# Altium project thru hole preamp amps and LP+BP filter stages.PrjPcb
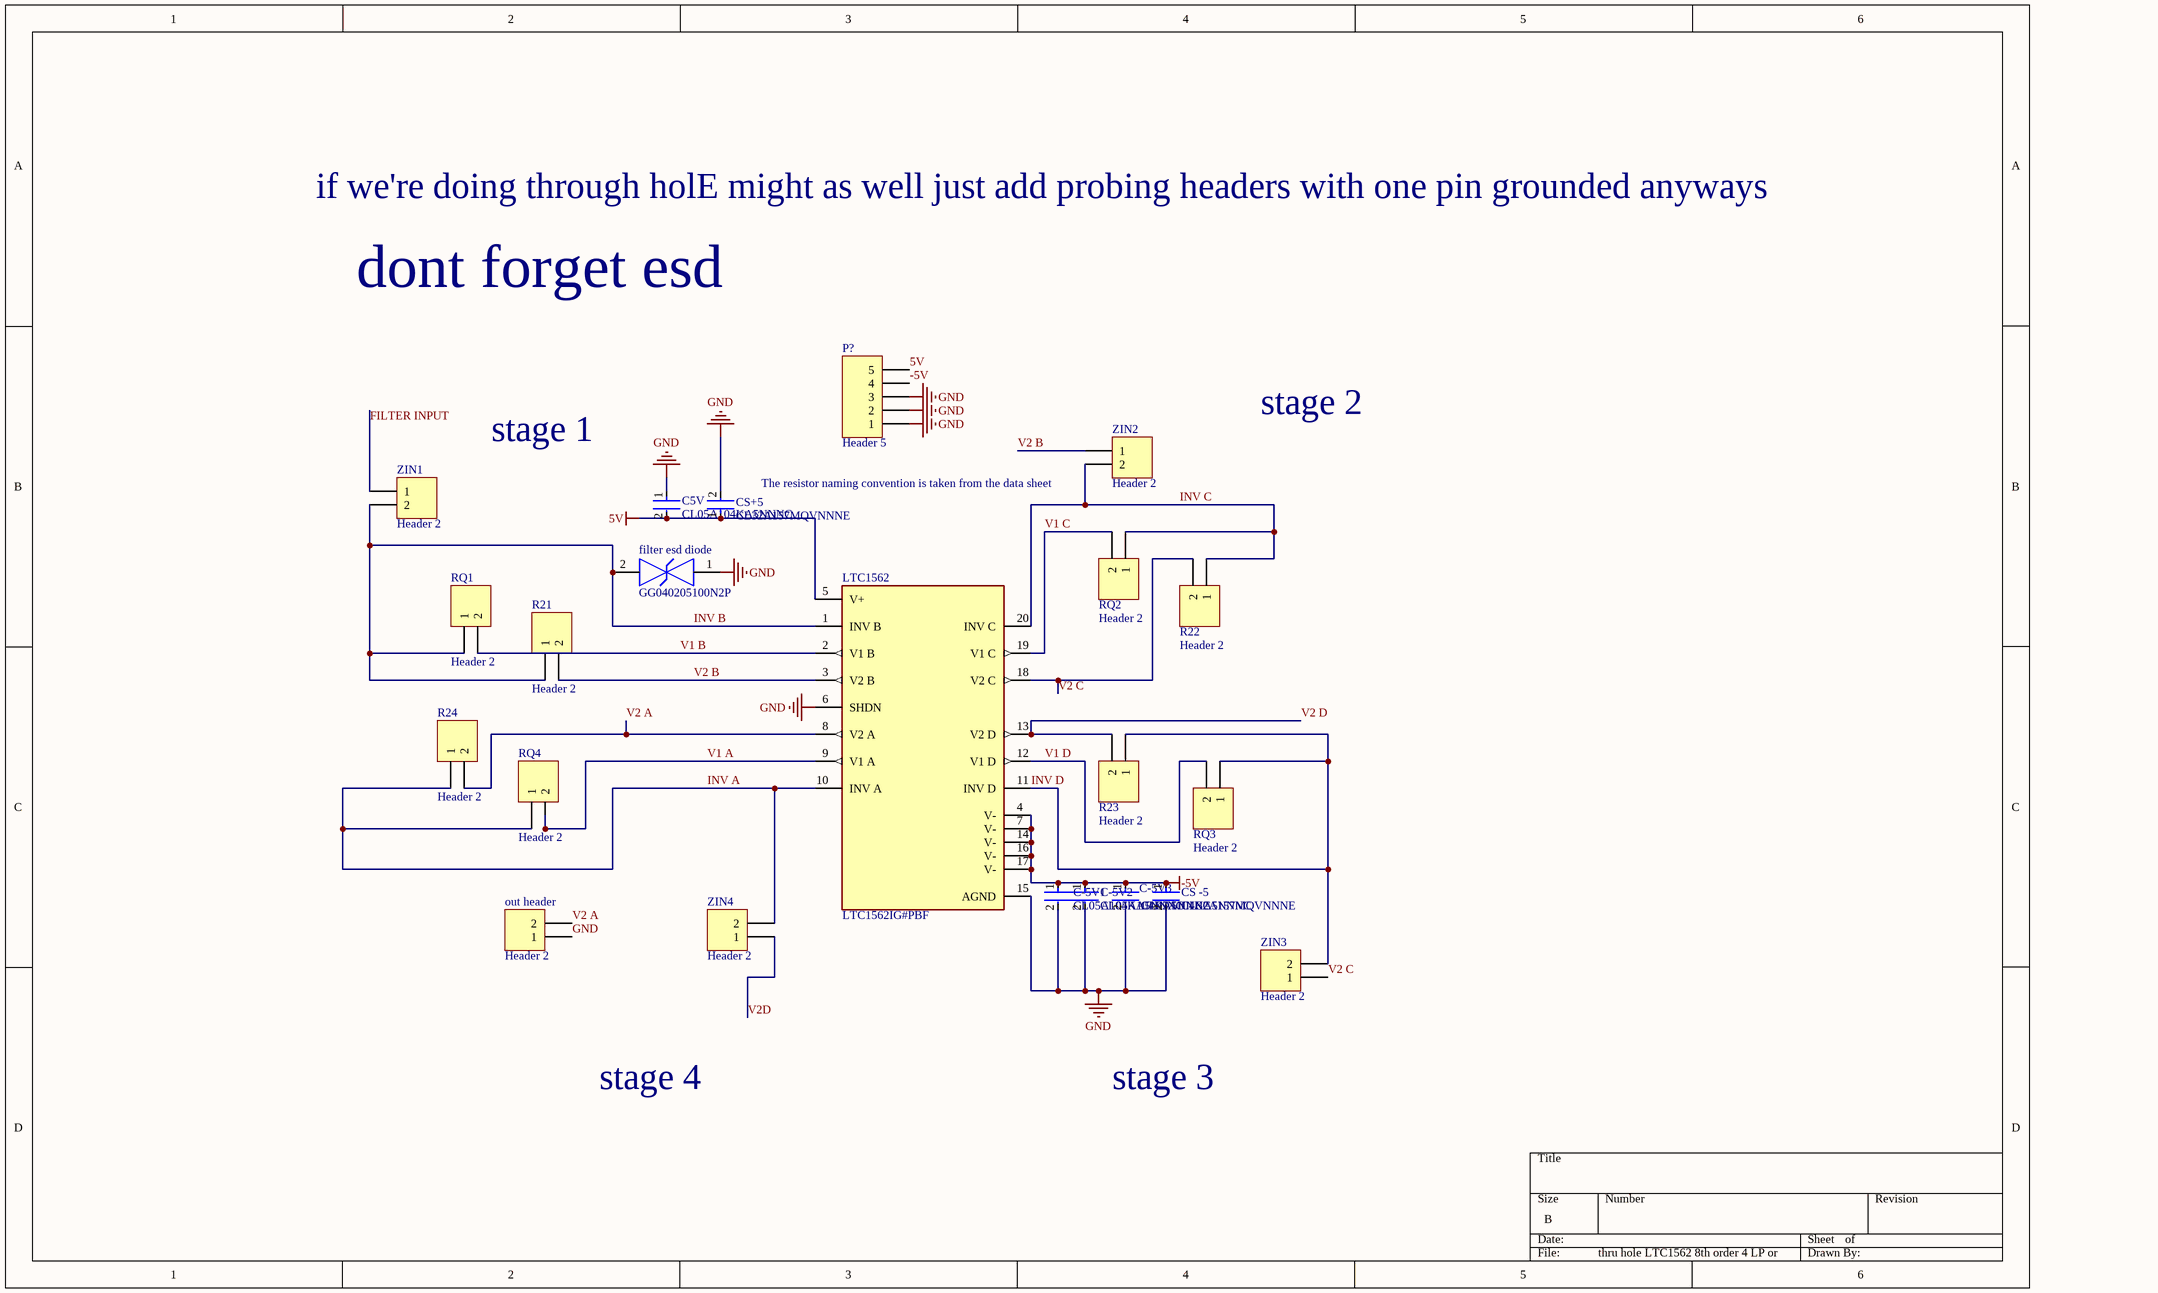
[diagram p0: thru hole LTC1562 8th order 4 LP or BP stages.SchDoc]
1 sheet, 22 parts. Net scope: global (net labels, ports and power ports of the same name join across sheets).
Board files: thru hole LTC1562 8th order 4 LP or BP stages.PcbDoc, CASCADED thru hole preamp amps and LP+BP filter stages.PcbDoc

## Sheet thru hole LTC1562 8th order 4 LP or BP stages.SchDoc
size B; SheetNumber: 1; SheetTotal: 2

### Parts
C5V  CL05A104KA5NNNC  [FP-CL278-IPC_C]
C-5V1  CL05A104KA5NNNC  [FP-CL278-IPC_C]
C-5V2  CL05A104KA5NNNC  [FP-CL278-IPC_C]
C-5V3  CL05A104KA5NNNC  [FP-CL278-IPC_C]
CS+5  CL32A157MQVNNNE  [FP-CL32-IPC_C]
CS_-5  CL32A157MQVNNNE  [FP-CL32-IPC_C]
filter_esd_diode  GG040205100N2P  [FP-GG0402-MFG]
LTC1562  LTC1562IG#PBF  [FP-G-20-05-08-1640-MFG]
out_header  Header 2  [HDR1X2]
P?  Header 5  [HDR1X5]
R21  Header 2  [HDR1X2]
R22  Header 2  [HDR1X2]
R23  Header 2  [HDR1X2]
R24  Header 2  [HDR1X2]
RQ1  Header 2  [HDR1X2]
RQ2  Header 2  [HDR1X2]
RQ3  Header 2  [HDR1X2]
RQ4  Header 2  [HDR1X2]
ZIN1  Header 2  [HDR1X2]
ZIN2  Header 2  [HDR1X2]
ZIN3  Header 2  [HDR1X2]
ZIN4  Header 2  [HDR1X2]

### Nets
5V: C5V.2 CS+5.1 LTC1562.5(V+) P?.5
-5V: C-5V1.1 C-5V2.1 C-5V3.1 CS_-5.1 LTC1562.4(V-) LTC1562.7(V-) LTC1562.14(V-) LTC1562.16(V-) LTC1562.17(V-) P?.4
GND: C5V.1 C-5V1.2 C-5V2.2 C-5V3.2 CS+5.2 CS_-5.2 filter_esd_diode.1(IO_1) LTC1562.6(SHDN) LTC1562.15(AGND) out_header.1 P?.1 P?.2 P?.3
FILTER INPUT: ZIN1.1
INV A: LTC1562.10(INV_A) R24.1 RQ4.1 ZIN4.2
INV B: filter_esd_diode.2(IO_2) LTC1562.1(INV_B) R21.1 RQ1.1 ZIN1.2
INV C: LTC1562.20(INV_C) R22.1 RQ2.1 ZIN2.2
INV D: LTC1562.11(INV_D) R23.1 RQ3.1 ZIN3.2
V1 A: LTC1562.9(V1_A) RQ4.2
V1 B: LTC1562.2(V1_B) RQ1.2
V1 C: LTC1562.19(V1_C) RQ2.2
V1 D: LTC1562.12(V1_D) RQ3.2
V2 A: LTC1562.8(V2_A) out_header.2 R24.2
V2 B: LTC1562.3(V2_B) R21.2 ZIN2.1
V2 C: LTC1562.18(V2_C) R22.2 ZIN3.1
V2 D: LTC1562.13(V2_D) R23.2
V2D: ZIN4.1

### Notes on the sheet
- if we're doing through holE might as well just add probing headers with one pin grounded anyways
- dont forget esd
- stage 2
- stage 1
- (near ZIN2) The resistor naming convention is taken from the data sheet
- stage 4
- stage 3

### Library data of the parts
C5V C-5V1-C-5V3 = CMP-13271-000728-1: Cap Ceramic 100nF 25V X5R ±10% SMD 0402 +85°C Paper T/R; Package Quantity: 1; Height: 0.5mm; Case Code (Metric): 1005; Thickness: 0.022inch; Mount: Surface Mount; Lead Free: Lead Free; Case Code (Imperial): 0402; Packaging: Tape and Reel; Depth: 0.5mm; Voltage: 25V; Min Operating Temperature: -55°C; Voltage Rating: 25V; Dielectric: X5R; Case/Package: 0402; Tolerance: 10%; Width: 0.02inch; Max Operating Temperature: 85°C; Capacitance: 100nF; Length: 1mm; Radiation Hardening: No; Voltage Rating (DC): 25V
CS+5 CS_-5 = CMP-2000-06109-2: Cap Ceramic 150uF 6.3V X5R ±20% SMD 1210 +85°C Embossed T/R; Width: 0.098inch; Case Code (Metric): 3225; Capacitance: 150uF; Case/Package: 1210; Package Quantity: 1; Voltage Rating (DC): 6.3V; Mount: Surface Mount; Packaging: Tape and Reel; Max Operating Temperature: 85°C; Case Code (Imperial): 1210; Tolerance: 20%; Length: 0.126inch; Thickness: 0.11inch; Min Operating Temperature: -55°C; Voltage Rating: 6.3V; Lead Free: Lead Free
filter_esd_diode = CMP-04587-000001-1: TVS DIODE 5V 12V 0402; Manufacturer: AVX Corporation; Number Of Channels: 1; Peak Pulse Current: 16A; Capacitance: 10pF; Direction: Bidirectional; Value: 10pF; Breakdown Voltage: 5.5V; Peak Pulse Power: 96W; Automotive: No; ComponentLink2URL: http://datasheets.avx.com/AVX-GiGuard.pdf; Manufacturer Part Number: GG040205100N2P; Lead Free: Yes; Device Class L2: TVS Diodes; Temperature: -55°C to +125°C; Category: Diode; Reverse Standoff Voltage: 5V; Octopart: https://octopart.com/gg040205100n2p-avx-81066081; Clamping Voltage: 12V; Ipc Land Pattern Name: DIOC10060X50; Digikey Description: TVS DIODE 5V 12V 0402; Device Class L3: unset; ComponentLink2Description: Datasheet; Temperature Range Low: -55°C; Temperature Range High: +125°C; Device Class L1: Circuit Protection; Height: 0.55mm; Package: GG0402; RoHS: TRUE
LTC1562 = CMP-09114-000012-1: IC FILTER 150KHZ UNIV 20SSOP; Nominal Supply Current: 19mA; Filter Type: UNIVERSAL; Max Supply Voltage: 10.5V; Number of Circuits: 4; Max Dual Supply Voltage: 5.25V; Min Supply Voltage: 4.75V; Dual Supply Voltage: 5V; Min Dual Supply Voltage: 2.375V; Max Operating Temperature: 85°C; Length: 7.33mm; Width: 5.38mm; Radiation Hardening: No; Lead Free: Lead Free; Series: -; Package Quantity: 66; Number of Pins: 20; RoHS Compliant: Yes; Case/Package: SSOP; Type: Active; Min Operating Temperature: -40°C; Packaging: Rail/Tube; Mount: Surface Mount; Height: 1.78mm; Supply Current: 19mA
out_header R21-R24 RQ1-RQ4 ZIN1-ZIN4 = Header 2: Header, 2-Pin; LatestRevisionDate: 17-Jul-2002; LatestRevisionNote: Re-released for DXP Platform.; Publisher: Altium Limited
P? = Header 5: Header, 5-Pin; LatestRevisionDate: 17-Jul-2002; LatestRevisionNote: Re-released for DXP Platform.; Publisher: Altium Limited